# EAGLE design applicant_skillchk (EAGLE 6.2)
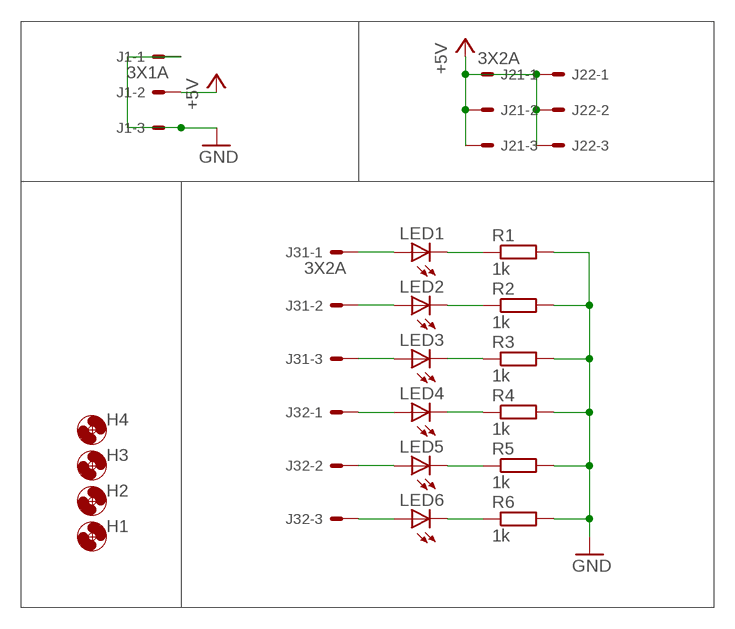
[diagram p0: schematic, sheet 1]

## Parts
H1  HOLE3.3M3BOLT  [HOLE3.3]
H2  HOLE3.3M3BOLT  [HOLE3.3]
H3  HOLE3.3M3BOLT  [HOLE3.3]
H4  HOLE3.3M3BOLT  [HOLE3.3]
J1  3X1A  [37203-62A3-003]
J2  3X2A  [37206-62A3-003]
J3  3X2A  [37206-62A3-003]
LED1  LED5MM  [LED5MM]
LED2  LED5MM  [LED5MM]
LED3  LED5MM  [LED5MM]
LED4  LED5MM  [LED5MM]
LED5  LED5MM  [LED5MM]
LED6  LED5MM  [LED5MM]
R1  1k  R-EU_R3216W  [R3216W]
R2  1k  R-EU_R3216W  [R3216W]
R3  1k  R-EU_R3216W  [R3216W]
R4  1k  R-EU_R3216W  [R3216W]
R5  1k  R-EU_R3216W  [R3216W]
R6  1k  R-EU_R3216W  [R3216W]

## Nets
+5V: J1.1-2 J2.1-1 J2.1-2 J2.1-3 J2.2-1 J2.2-2 J2.2-3
GND: J1.1-1 J1.1-3 R1.2 R2.2 R3.2 R4.2 R5.2 R6.2
N$3: LED1.K(C) R1.1
N$4: LED2.K(C) R2.1
N$5: LED3.K(C) R3.1
N$6: LED4.K(C) R4.1
N$7: LED5.K(C) R5.1
N$8: LED6.K(C) R6.1
N$9: J3.1-1 LED1.A
N$10: J3.1-2 LED2.A
N$11: J3.1-3 LED3.A
N$12: J3.2-1 LED4.A
N$13: J3.2-2 LED5.A
N$14: J3.2-3 LED6.A

## Library data of the parts
H1-H4 = Hole:HOLE3.3
J1 = 3M_372xx:3X1
J2 J3 = 3M_372xx:3X2
LED1-LED6 = FP-21T for MITS:LED: LED OSRAM: - CHIPLED LG R971, LG N971, LY N971, LG Q971, LY Q971, LO R971, LY R971 LH N974, LH R974 LS Q976, LO Q976, LY Q976 LO Q996 - Hyper CHIPLED LW Q18S LB Q993, LB Q99A, LB R99A - SideLED LS A670, LO A670, LY A670, LG A670, LP A670 LB A673, LV A673, LT A673, LW A673 LH A674 LY A675 LS A676, LA A676, LO A676, LY A676, LW A676 LS A679, LY A679, LG A679 - Hyper Micro SIDELED® LS Y876, LA Y876, LO Y876, LY Y876 LT Y87S - SmartLED LW L88C, LW L88S LB L89C, LB L89S, LG L890 LS L89K, LO L89K, LY L89K LS L896, LA L896, LO L896, LY L896 - TOPLED LS T670, LO T670, LY T670, LG T670, LP T670 LSG T670, LSP T670, LSY T670, LOP T670, LYG T670 LG T671, LOG T671, LSG T671 LB T673, LV T673, LT T673, LW T673 LH T674 LS T676, LA T676, LO T676, LY T676, LB T676, LH T676, LSB T676, LW T676 LB T67C, LV T67C, LT T67C, LS T67K, LO T67K, LY T67K, LW E67C LS E67B, LA E67B, LO E67B, LY E67B, LB E67C, LV E67C, LT E67C LW T67C LS T679, LY T679, LG T679 LS T770, LO T770, LY T770, LG T770, LP T770 LB T773, LV T773, LT T773, LW T773 LH T774 LS E675, LA E675, LY E675, LS T675 LS T776, LA T776, LO T776, LY T776, LB T776 LHGB T686 LT T68C, LB T68C - Hyper Mini TOPLED® LB M676 - Mini TOPLED Santana® LG M470 LS M47K, LO M47K, LY M47K Source: http://www.osram.convergy.de - LUMILED® LXK2-PW12-R00, LXK2-PW12-S00, LXK2-PW14-U00, LXK2-PW14-V00 LXK2-PM12-R00, LXK2-PM12-S00, LXK2-PM14-U00 LXK2-PE12-Q00, LXK2-PE12-R00, LXK2-PE12-S00, LXK2-PE14-T00, LXK2-PE14-U00 LXK2-PB12-K00, LXK2-PB12-L00, LXK2-PB12-M00, LXK2-PB14-N00, LXK2-PB14-P00, LXK2-PB14-Q00 LXK2-PR12-L00, LXK2-PR12-M00, LXK2-PR14-Q00, LXK2-PR14-R00 LXK2-PD12-Q00, LXK2-PD12-R00, LXK2-PD12-S00 LXK2-PH12-R00, LXK2-PH12-S00 LXK2-PL12-P00, LXK2-PL12-Q00, LXK2-PL12-R00 Source: www.luxeon.com
R1-R6 = rcl:R-EU_: RESISTOR, European symbol

## Board
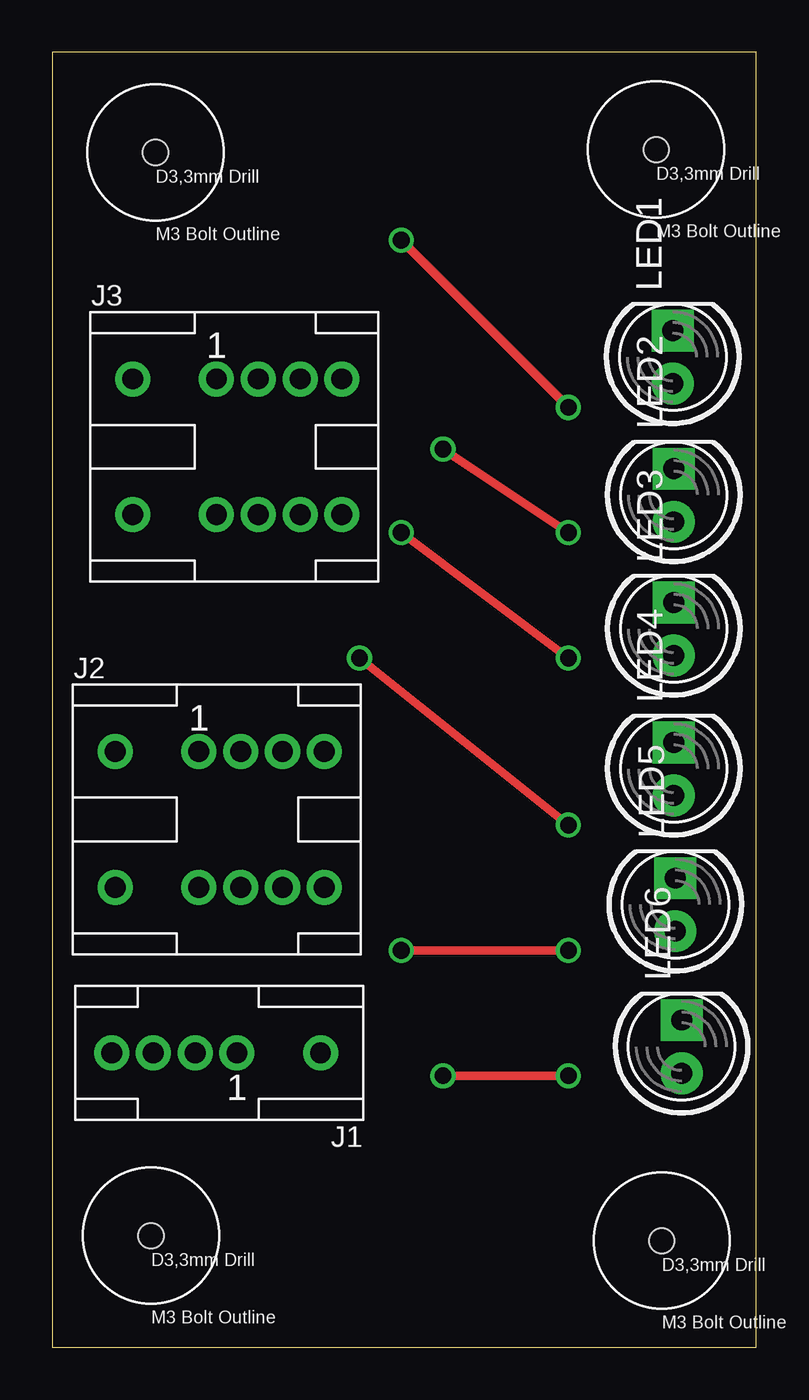
[diagram p1: board, top side]
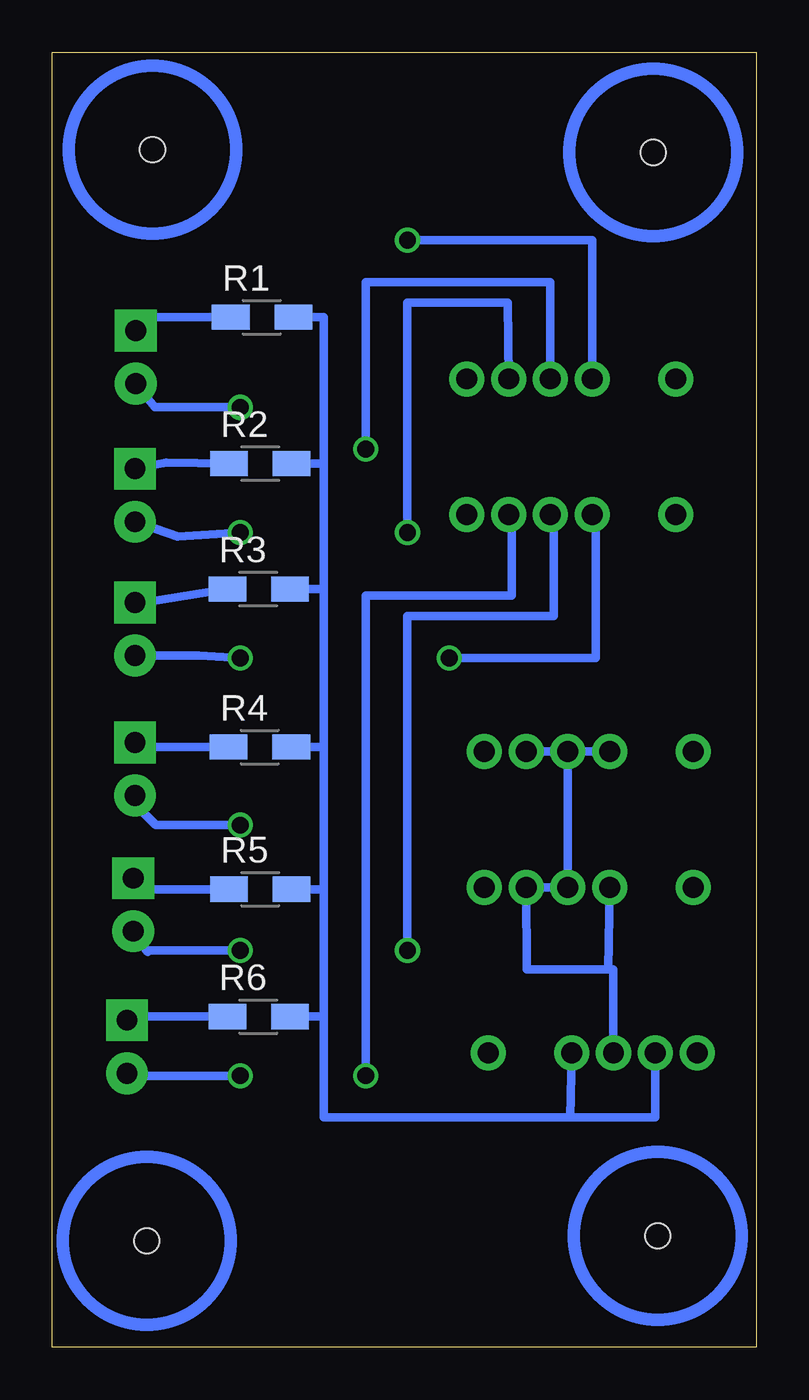
[diagram p2: board, bottom side, seen from below]

Size 33.7 x 62 mm. Coordinates in mm from the lower left corner, seen from the top.
Outline: 0,0 33.7,0 33.7,62 0,62 0,0
Copper layers (1*16): Top 0.035mm / dielectric 1.5mm / Bottom 0.035mm
Design rules: minimum track width 10mil, minimum drill 24mil, track to track 8mil, track to pad 8mil, pad to pad 8mil, via to via 8mil, smd to smd 8mil, copper to edge 40mil, drill to drill 8mil, minimum pad ring 10mil, minimum via ring 8mil, stop-mask expansion 4mil, vias tented up to drill 0mil, thermal gap 10mil

### Footprints (pad centres in the part's own frame; a part is rotated, then mirrored left to right if it is on the bottom)
HOLE3.3 = hole 1.2: 0,0
37203-62A3-003 = drill 1 pad 1.676: 1-1 0,4; 1-2 0,6; 1-3 0,8; P$1 0,0; P$2 0,10
37206-62A3-003 = drill 1 pad 1.676: 1-1 0,4; 1-2 0,6; 1-3 0,8; 2-1 6.5,4; 2-2 6.5,6; 2-3 6.5,8; P$1 0,0; P$2 0,10; P$3 6.5,0; P$4 6.5,10
LED5MM = drill 1 pad 2: A -1.27,0 | drill 1 pad 2 square: K 1.27,0
R3216W = smd 1.8 x 1.2: 1 -1.499,0; 2 1.499,0

### Placement (x,y rotation side)
H1  29.17,5.1 0 top
H2  4.94,57.2 0 top
H3  4.73,5.34 0 top
H4  28.9,57.34 0 top
J1  12.84,14.1 90 top
J2  3.02,28.52 270 top
J3  3.86,46.36 270 top
LED1  29.7,47.4 90 top
LED2  29.74,40.79 90 top
LED3  29.74,34.39 90 top
LED4  29.74,27.69 90 top
LED5  29.82,21.19 90 top
LED6  30.12,14.39 90 top
R1  23.66,49.31 0 bottom
R2  23.74,42.31 0 bottom
R3  23.82,36.31 0 bottom
R4  23.76,28.73 0 bottom
R5  23.74,21.93 0 bottom
R6  23.82,15.83 0 bottom

### Tracks (layer width: path | path; a pad name or v marks a point on that pad's centre or on a via)
+5V
  Bottom 0.406: J1.1-2 6.84,18.1 | 6.84,18.1 7.1,18.1 | 7.1,18.1 6.84,18.1 | 6.84,18.1 8.3,18.1 11,18.1 J2.2-3 J2.2-2 J2.1-2 | J2.1-2 J2.1-3 | J2.1-2 J2.1-1 | J2.2-1 7.1,18.1
GND
  Bottom 0.406: R1.2 20.7,49.31 20.7,42 | 20.7,42 20.7,36 | 20.7,36 20.7,29 | 20.7,29 20.7,22 | 20.7,22 20.7,16 | 20.7,15.83 20.7,11 8.9,11 | 20.7,15.83 20.7,16 | R6.2 20.7,15.83 | 20.7,15.83 20.7,16 | R2.2 22.32,42.31 20.7,42.31 20.7,42 | R3.2 22.26,36.31 20.7,36.31 20.7,36 | 22.24,28.73 R4.2 20.7,28.73 20.7,29 | 22.32,21.93 R5.2 20.7,21.93 20.7,22 | 8.9,11 4.84,11 J1.1-3 | J1.1-1 8.9,11
N$3
  Bottom 0.406: R1.1 29.8,49.31 LED1.K
N$4
  Bottom 0.406: R2.1 28.24,42.36 LED2.K
N$5
  Bottom 0.406: R3.1 29.32,35.66 LED3.K
N$6
  Bottom 0.406: R4.1 28.74,28.73 LED4.K
N$7
  Bottom 0.406: R5.1 29.82,21.93 LED5.K
N$8
  Bottom 0.406: R6.1 29.12,15.83 LED6.K
N$9  (via drill 0.8)
  Top 0.406: v16.7,53 v24.7,45
  Bottom 0.406: J3.1-1 7.86,53 v16.7,53 | v24.7,45 27.7,45 28.8,45 LED1.A
N$10  (via drill 0.8)
  Top 0.406: v18.7,43 v24.7,39
  Bottom 0.406: J3.1-2 9.86,51 18.7,51 v18.7,43 | v24.7,39 27.7,38.82 LED2.A
N$11  (via drill 0.8)
  Top 0.406: v24.7,33 v16.7,39
  Bottom 0.406: v16.7,39 16.7,50 11.9,50 J3.1-3 | v24.7,33 26.7,33.12 LED3.A
N$12  (via drill 0.8)
  Top 0.406: v24.7,25 v14.7,33
  Bottom 0.406: v14.7,33 7.7,33 7.7,39.86 J3.2-1 | v24.7,25 28.74,25 29.74,26 LED4.A
N$13  (via drill 0.8)
  Top 0.406: v24.7,19 v16.7,19
  Bottom 0.406: v16.7,19 16.7,35 9.7,35 9.7,39.86 J3.2-2 | v24.7,19 29.12,19 29.12,18.92 LED5.A
N$14  (via drill 0.8)
  Top 0.406: v24.7,13 v18.7,13
  Bottom 0.406: v18.7,13 18.7,36 11.7,36 11.7,39.86 J3.2-3 | v24.7,13 28.12,13 30.12,13 LED6.A